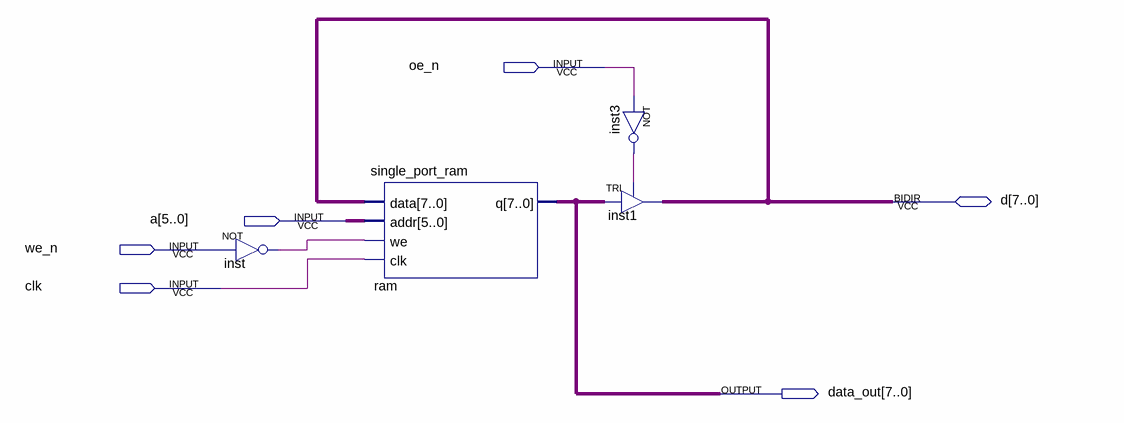
[diagram p0: schematic sheet]
// Quartus schematic RAM1.bdf as structural Verilog: 4 symbols, 6 pins
module RAM1 (
  input  oe_n,
  input  [5:0] a,
  input  we_n,
  input  clk,
  inout  [7:0] d,
  output [7:0] data_out
);

  wire inst3_out, inst_out;

  not inst (inst_out, we_n);
  single_port_ram ram (.data(d), .addr(a), .we(inst_out), .clk(clk), .q(data_out));
  TRI inst1[7:0] (.IN(data_out), .OE(inst3_out), .OUT(d));
  not inst3 (inst3_out, oe_n);
endmodule
